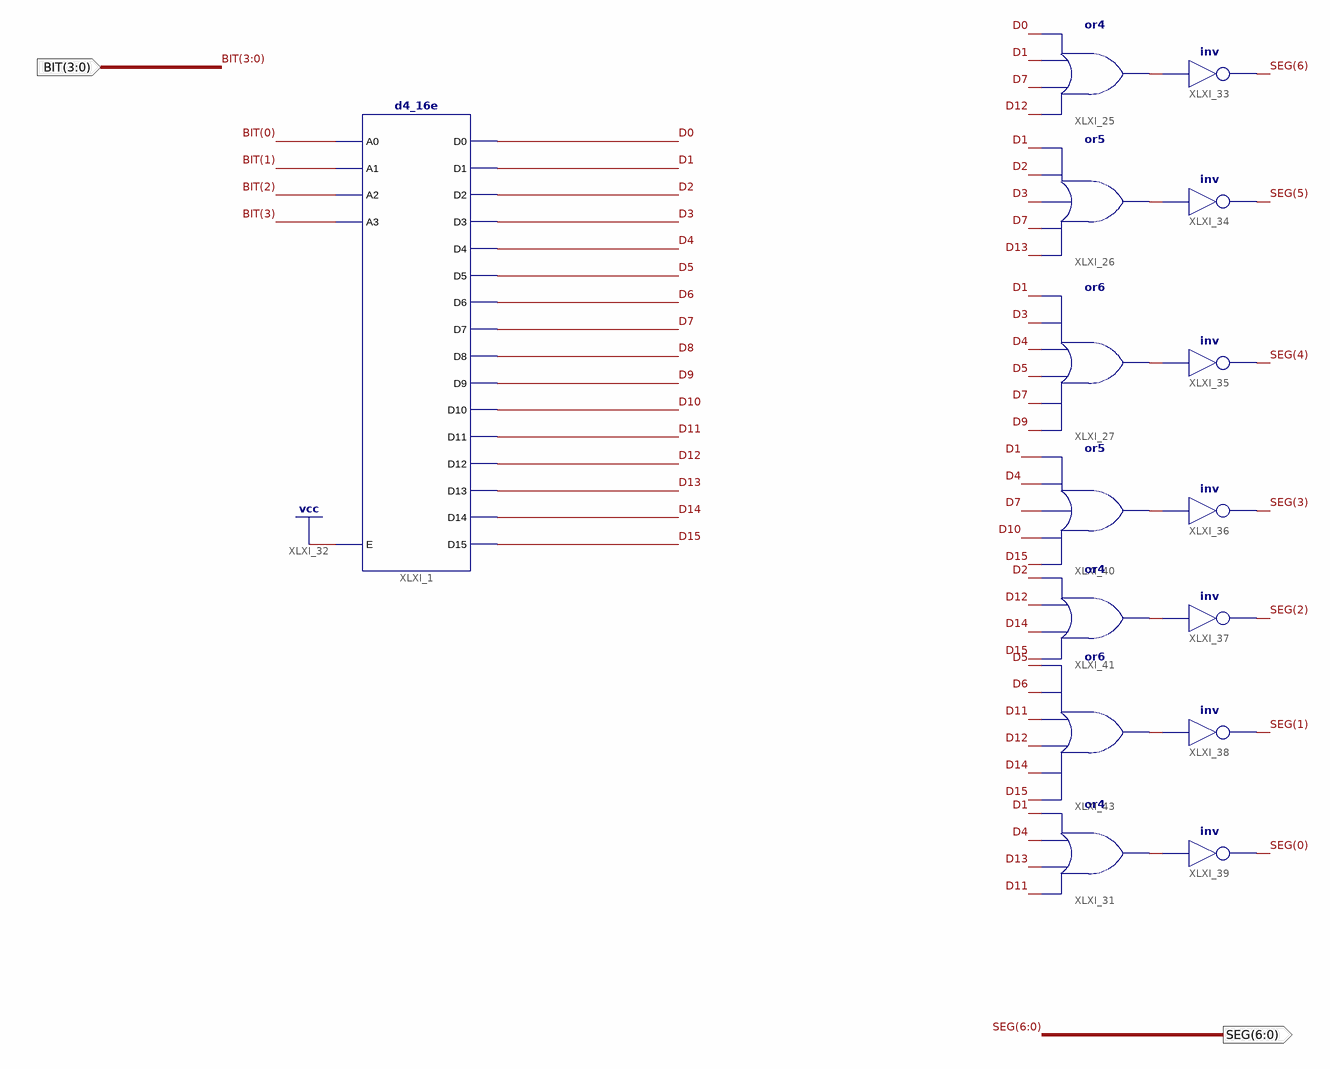
[diagram p0: schematic sheet 1]
// Xilinx ISE schematic BCD_0_F_Decoder.sch (spartan6) as structural Verilog: 15 symbols, 2 ports
module BCD_0_F_Decoder (
  input  [3:0] BIT,
  output [6:0] SEG
);

  wire A, B, C, D0, D1, D2, D3, D4, D5, D6, D7, D8, D9, D10, D11, D12, D13, D14, D15, E, F, G, XLXN_38;

  d4_16e XLXI_1 (
    .A0(BIT[0]), .A1(BIT[1]), .A2(BIT[2]), .A3(BIT[3]), .E(1'b1), .D0(D0), .D1(D1), .D10(D10), .D11(D11),
    .D12(D12), .D13(D13), .D14(D14), .D15(D15), .D2(D2), .D3(D3), .D4(D4), .D5(D5), .D6(D6), .D7(D7),
    .D8(D8), .D9(D9));
  or XLXI_25 (G, D12, D7, D1, D0);
  or XLXI_26 (F, D13, D7, D3, D2, D1);
  or XLXI_27 (E, D9, D7, D5, D4, D3, D1);
  or XLXI_31 (A, D11, D13, D4, D1);
  not XLXI_33 (SEG[6], G);
  not XLXI_34 (SEG[5], F);
  not XLXI_35 (SEG[4], E);
  not XLXI_36 (SEG[3], XLXN_38);
  not XLXI_37 (SEG[2], C);
  not XLXI_39 (SEG[0], A);
  or XLXI_40 (XLXN_38, D15, D10, D7, D4, D1);
  or XLXI_41 (C, D15, D14, D12, D2);
  not XLXI_38 (SEG[1], B);
  or XLXI_43 (B, D15, D14, D12, D11, D6, D5);
endmodule
